# Altium schematic sheet Sh_USB.SchDoc
size 199 x 119 mm
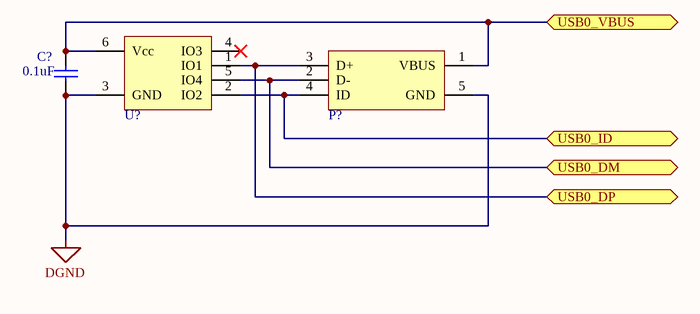
[diagram p0: Sh_USB.SchDoc]

## Parts
C?  value 0.1uF  [C1206]
P?  87520-0010BLF  (value not drawn)
U?  TPD4E001DBVR  (value not drawn)

## Ports
USB0_DM, USB0_DP, USB0_ID, USB0_VBUS

## Nets
DGND: C?.2 P?.5(GND) U?.3(GND)
USB0_DM: P?.2(D-) U?.5(IO4) ; port USB0_DM
USB0_DP: P?.3(D+) U?.1(IO1) ; port USB0_DP
USB0_ID: P?.4(ID) U?.2(IO2) ; port USB0_ID
USB0_VBUS: C?.1 P?.1(VBUS) U?.6(Vcc) ; port USB0_VBUS

Not connected (* = marked no-connect by the designer): U? 4(IO3)*

## Library data of the parts
C? = Cap Semi: Capacitor (Semiconductor SIM Model)
P? = 87520-0010BLF: USB_Mini_femelle
U? = TPD4E001DBVR: Protection_ESD